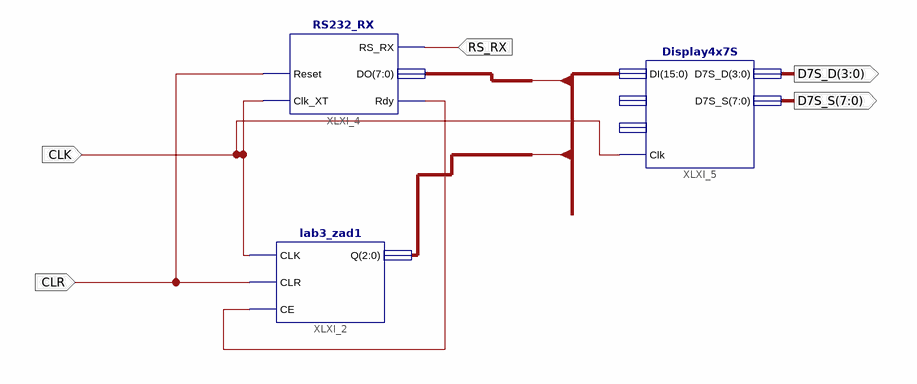
[diagram p0: schematic sheet 1]
// Xilinx ISE schematic hesLab3.sch (xc9500xl) as structural Verilog: 3 symbols, 5 ports
module hesLab3 (
  input  CLK,
  input  CLR,
  input  RS_RX,
  output [3:0] D7S_D,
  output [7:0] D7S_S
);

  wire XLXN_18;
  wire [15:0] X;

  lab3_zad1 XLXI_2 (.CLK(CLK), .CLR(CLR), .CE(XLXN_18), .Q(X[14:12]));
  RS232_RX XLXI_4 (.Reset(CLR), .Clk_XT(CLK), .Rdy(XLXN_18), .DO(X[7:0]), .RS_RX(RS_RX));
  Display4x7S XLXI_5 (.DI(X), .D7S_D(D7S_D), .D7S_S(D7S_S), .Clk(CLK));  // open: DP, Blank
endmodule
